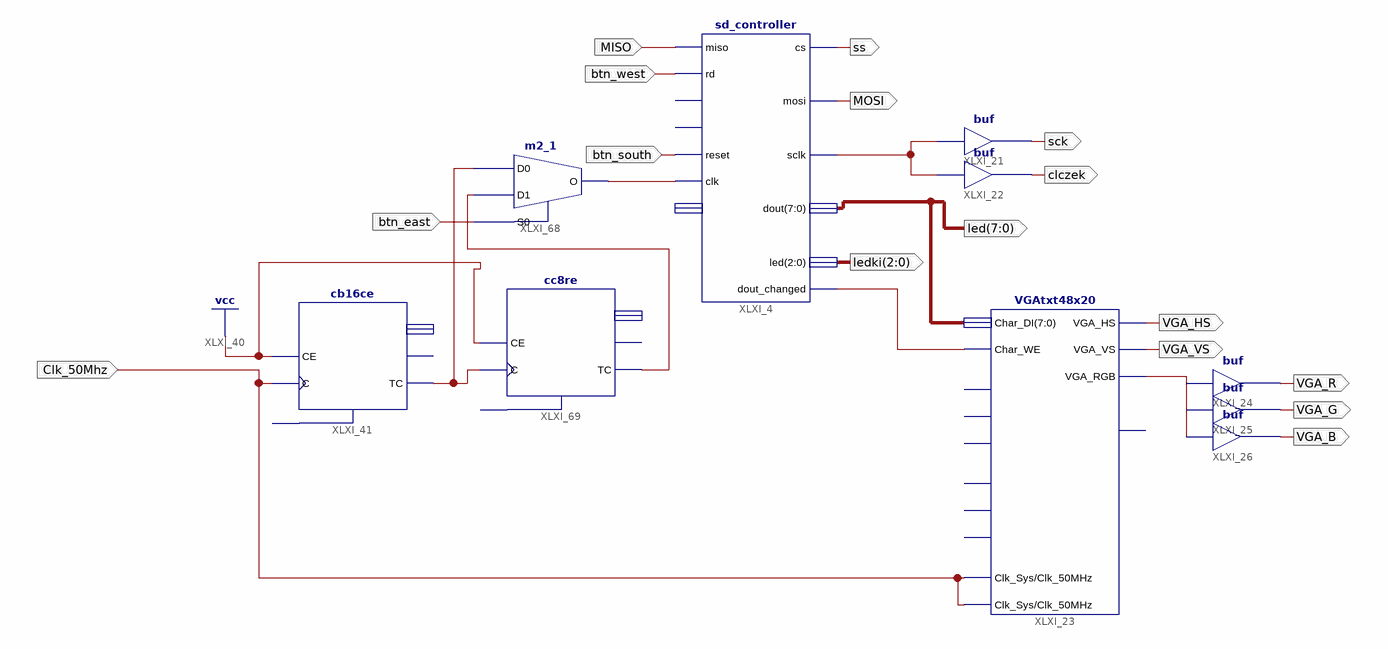
[diagram p0: schematic sheet 1]
// Xilinx ISE schematic schematGlownyStevena.sch (spartan3e) as structural Verilog: 10 symbols, 16 ports
module schematGlownyStevena (
  input  MISO,
  input  btn_west,
  input  Clk_50Mhz,
  input  btn_east,
  input  btn_south,
  output MOSI,
  output [7:0] led,
  output [2:0] ledki,
  output ss,
  output sck,
  output clczek,
  output VGA_HS,
  output VGA_VS,
  output VGA_R,
  output VGA_G,
  output VGA_B
);

  wire XLXN_55, XLXN_88, XLXN_179, XLXN_181, XLXN_189, XLXN_194;

  sd_controller XLXI_4 (
    .miso(MISO), .rd(btn_west), .reset(btn_south), .clk(XLXN_189), .cs(ss), .mosi(MOSI), .sclk(XLXN_55),
    .led(ledki), .dout(led), .dout_changed(XLXN_179));  // open: wr, dm_in, din
  buf XLXI_21 (sck, XLXN_55);
  buf XLXI_22 (clczek, XLXN_55);
  VGAtxt48x20 XLXI_23 (
    .Char_DI(led), .Clk_Sys(Clk_50Mhz), .Clk_50MHz(Clk_50Mhz), .VGA_HS(VGA_HS), .VGA_VS(VGA_VS),
    .VGA_RGB(XLXN_88), .Char_WE(XLXN_179));  // open: Home, NewLine, Goto00, CursorOn, ScrollEn, ScrollClear, Busy
  buf XLXI_24 (VGA_R, XLXN_88);
  buf XLXI_25 (VGA_G, XLXN_88);
  buf XLXI_26 (VGA_B, XLXN_88);
  cb16ce XLXI_41 (.C(Clk_50Mhz), .CE(1'b1), .TC(XLXN_181));  // open: CLR, CEO, Q
  m2_1 XLXI_68 (.D0(XLXN_181), .D1(XLXN_194), .S0(btn_east), .O(XLXN_189));
  cc8re XLXI_69 (.C(XLXN_181), .CE(1'b1), .TC(XLXN_194));  // open: R, CEO, Q
endmodule
